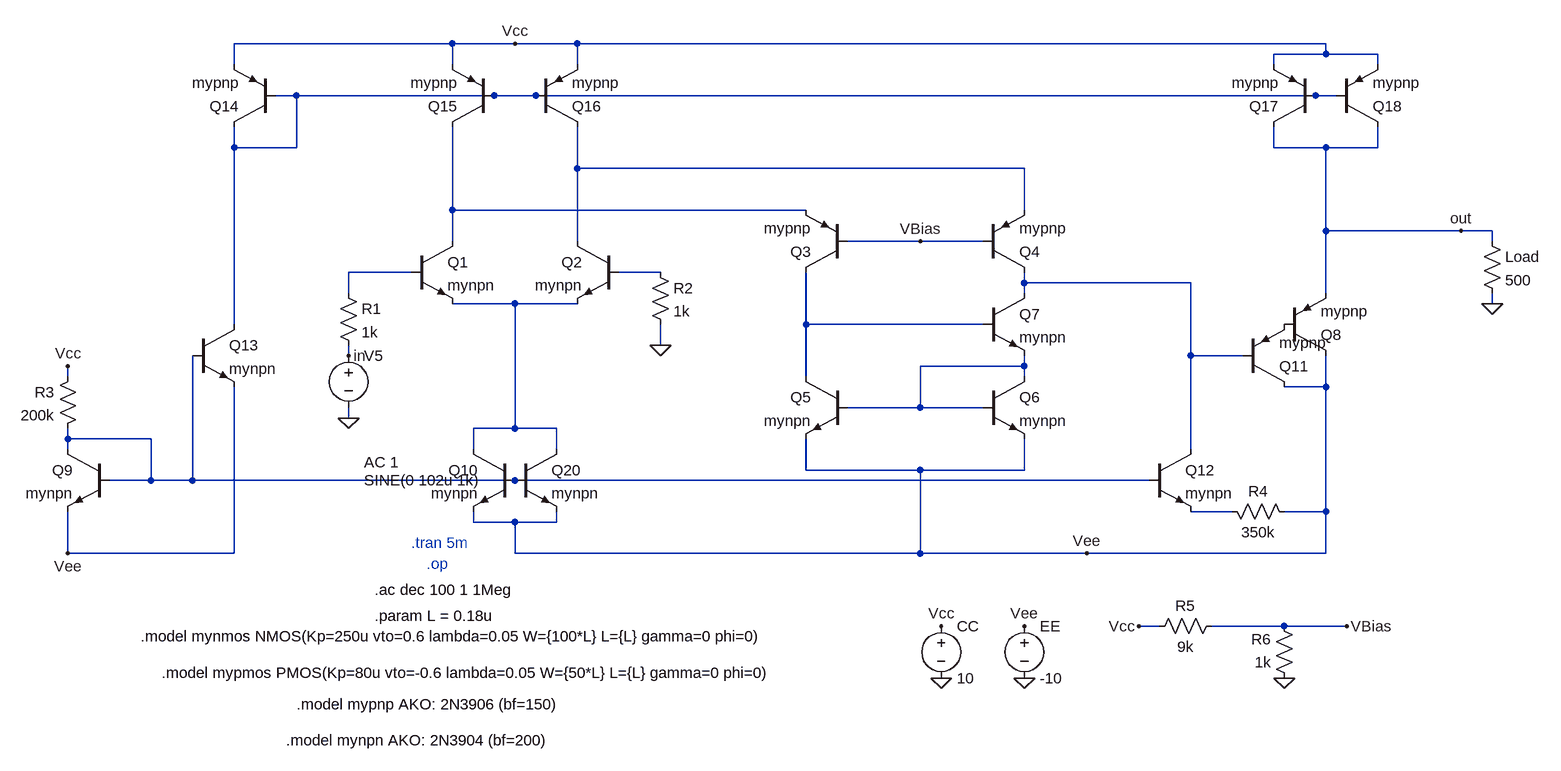
[diagram p0: schematic Ph1.asc]
Ph1.asc, the LTspice schematic file:
Version 4.1
SHEET 1 2180 916
WIRE 384 -320 48 -320
WIRE 480 -320 384 -320
WIRE 576 -320 480 -320
WIRE 1728 -320 576 -320
WIRE 1728 -304 1728 -320
WIRE 1728 -304 1648 -304
WIRE 1808 -304 1728 -304
WIRE 48 -288 48 -320
WIRE 384 -288 384 -320
WIRE 576 -288 576 -320
WIRE 1648 -288 1648 -304
WIRE 1808 -288 1808 -304
WIRE 144 -240 112 -240
WIRE 448 -240 144 -240
WIRE 512 -240 448 -240
WIRE 1712 -240 512 -240
WIRE 1744 -240 1712 -240
WIRE 48 -160 48 -192
WIRE 144 -160 144 -240
WIRE 144 -160 48 -160
WIRE 1648 -160 1648 -192
WIRE 1728 -160 1648 -160
WIRE 1808 -160 1808 -192
WIRE 1808 -160 1728 -160
WIRE 576 -128 576 -192
WIRE 1264 -128 576 -128
WIRE 384 -64 384 -192
WIRE 928 -64 384 -64
WIRE 1264 -64 1264 -128
WIRE 1728 -32 1728 -160
WIRE 1936 -32 1728 -32
WIRE 1984 -32 1936 -32
WIRE 384 -16 384 -64
WIRE 576 -16 576 -128
WIRE 1104 -16 992 -16
WIRE 1200 -16 1104 -16
WIRE 1984 -16 1984 -32
WIRE 320 32 224 32
WIRE 704 32 640 32
WIRE 1264 48 1264 32
WIRE 1520 48 1264 48
WIRE 224 64 224 32
WIRE 1264 64 1264 48
WIRE 1728 64 1728 -32
WIRE 480 80 384 80
WIRE 576 80 480 80
WIRE 1984 80 1984 64
WIRE 48 112 48 -160
WIRE 928 112 928 32
WIRE 1200 112 928 112
WIRE 704 144 704 112
WIRE 224 160 224 144
WIRE 1520 160 1520 48
WIRE 1600 160 1520 160
WIRE 1264 176 1264 160
WIRE 1264 176 1104 176
WIRE -208 192 -208 176
WIRE 928 192 928 112
WIRE 1264 192 1264 176
WIRE 1728 208 1728 160
WIRE 1728 208 1664 208
WIRE 1104 240 1104 176
WIRE 1104 240 992 240
WIRE 1200 240 1104 240
WIRE 224 256 224 240
WIRE 480 272 480 80
WIRE 480 272 416 272
WIRE 544 272 480 272
WIRE -208 288 -208 272
WIRE -80 288 -208 288
WIRE -208 304 -208 288
WIRE 416 304 416 272
WIRE 544 304 544 272
WIRE 1520 304 1520 160
WIRE 928 336 928 288
WIRE 1104 336 928 336
WIRE 1264 336 1264 288
WIRE 1264 336 1104 336
WIRE -80 352 -80 288
WIRE -80 352 -144 352
WIRE -16 352 -16 160
WIRE -16 352 -80 352
WIRE 480 352 -16 352
WIRE 1456 352 480 352
WIRE 1584 400 1520 400
WIRE 1728 400 1728 208
WIRE 1728 400 1664 400
WIRE 416 416 416 400
WIRE 480 416 416 416
WIRE 544 416 544 400
WIRE 544 416 480 416
WIRE -208 464 -208 400
WIRE 48 464 48 208
WIRE 48 464 -208 464
WIRE 480 464 480 416
WIRE 1104 464 1104 336
WIRE 1104 464 480 464
WIRE 1360 464 1104 464
WIRE 1728 464 1728 400
WIRE 1728 464 1360 464
WIRE 1472 576 1440 576
WIRE 1664 576 1552 576
WIRE 1760 576 1664 576
FLAG 1136 656 0
FLAG 1264 656 0
FLAG 1136 576 Vcc
FLAG 1264 576 Vee
FLAG 224 256 0
FLAG 480 -320 Vcc
FLAG 1984 80 0
FLAG 1936 -32 out
FLAG 1360 464 Vee
FLAG -208 464 Vee
FLAG -208 176 Vcc
FLAG 1664 656 0
FLAG 1440 576 Vcc
FLAG 1760 576 VBias
FLAG 1104 -16 VBias
FLAG 704 144 0
FLAG 224 160 in
DATAFLAG 384 -128 ""
DATAFLAG 256 32 ""
DATAFLAG 1344 48 ""
SYMBOL voltage 1136 560 R0
WINDOW 123 0 0 Left 0
WINDOW 39 0 0 Left 0
SYMATTR InstName CC
SYMATTR Value 10
SYMBOL voltage 1264 560 R0
WINDOW 123 0 0 Left 0
WINDOW 39 0 0 Left 0
SYMATTR InstName EE
SYMATTR Value -10
SYMBOL res 208 48 R0
SYMATTR InstName R1
SYMATTR Value 1k
SYMBOL npn 320 -16 R0
SYMATTR InstName Q1
SYMATTR Value mynpn
SYMBOL npn 640 -16 M0
SYMATTR InstName Q2
SYMATTR Value mynpn
SYMBOL res 688 16 R0
SYMATTR InstName R2
SYMATTR Value 1k
SYMBOL pnp 992 32 R180
SYMATTR InstName Q3
SYMATTR Value mypnp
SYMBOL pnp 1200 32 M180
SYMATTR InstName Q4
SYMATTR Value mypnp
SYMBOL npn 992 192 M0
SYMATTR InstName Q5
SYMATTR Value mynpn
SYMBOL npn 1200 192 R0
SYMATTR InstName Q6
SYMATTR Value mynpn
SYMBOL npn 1200 64 R0
SYMATTR InstName Q7
SYMATTR Value mynpn
SYMBOL res 1968 -32 R0
SYMATTR InstName Load
SYMATTR Value 500
SYMBOL npn -144 304 M0
SYMATTR InstName Q9
SYMATTR Value mynpn
SYMBOL res -192 176 M0
SYMATTR InstName R3
SYMATTR Value 200k
SYMBOL npn 480 304 M0
SYMATTR InstName Q10
SYMATTR Value mynpn
SYMBOL npn 1456 304 R0
SYMATTR InstName Q12
SYMATTR Value mynpn
SYMBOL res 1568 384 M90
WINDOW 0 0 56 VBottom 2
WINDOW 3 32 56 VTop 2
SYMATTR InstName R4
SYMATTR Value 350k
SYMBOL npn -16 112 R0
SYMATTR InstName Q13
SYMATTR Value mynpn
SYMBOL pnp 112 -192 R180
WINDOW 123 84 4 Left 2
SYMATTR InstName Q14
SYMATTR Value mypnp
SYMBOL pnp 448 -192 R180
WINDOW 123 84 4 Left 2
SYMATTR InstName Q15
SYMATTR Value mypnp
SYMBOL pnp 512 -192 M180
WINDOW 123 84 4 Left 2
SYMATTR InstName Q16
SYMATTR Value mypnp
SYMBOL pnp 1712 -192 R180
SYMATTR InstName Q17
SYMATTR Value mypnp
SYMBOL pnp 1744 -192 M180
SYMATTR InstName Q18
SYMATTR Value mypnp
SYMBOL npn 480 304 R0
SYMATTR InstName Q20
SYMATTR Value mynpn
SYMBOL voltage 224 144 R0
WINDOW 3 24 208 Left 2
WINDOW 123 24 180 Left 2
WINDOW 39 0 0 Left 0
SYMATTR Value SINE(0 102u 1k)
SYMATTR Value2 AC 1
SYMATTR InstName V5
SYMBOL pnp 1664 160 M180
SYMATTR InstName Q8
SYMATTR Value mypnp
SYMBOL pnp 1600 208 M180
SYMATTR InstName Q11
SYMATTR Value mypnp
SYMBOL res 1568 560 R90
WINDOW 0 0 56 VBottom 2
WINDOW 3 32 56 VTop 2
SYMATTR InstName R5
SYMATTR Value 9k
SYMBOL res 1680 672 R180
WINDOW 0 36 76 Left 2
WINDOW 3 36 40 Left 2
SYMATTR InstName R6
SYMATTR Value 1k
TEXT 264 560 Left 2 !.param L = 0.18u
TEXT -96 592 Left 2 !.model mynmos NMOS(Kp=250u vto=0.6 lambda=0.05 W={100*L} L={L} gamma=0 phi=0)
TEXT -64 648 Left 2 !.model mypmos PMOS(Kp=80u vto=-0.6 lambda=0.05 W={50*L} L={L} gamma=0 phi=0)
TEXT 144 696 Left 2 !.model mypnp AKO: 2N3906 (bf=150)
TEXT 128 752 Left 2 !.model mynpn AKO: 2N3904 (bf=200)
TEXT 344 480 Left 2 ;.op
TEXT 264 520 Left 2 !.ac dec 100 1 1Meg
TEXT 320 448 Left 2 ;.tran 5m

The netlist it stands for:
* Ph1.asc
V§CC Vcc 0 10
V§EE Vee 0 -10
R1 N004 in 1k
Q1 N003 N004 N007 0 mynpn
Q2 N002 N005 N007 0 mynpn
R2 N005 0 1k
Q3 N008 VBias N003 0 mypnp
Q4 N006 VBias N002 0 mypnp
Q5 N008 N009 Vee 0 mynpn
Q6 N009 N009 Vee 0 mynpn
Q7 N006 N008 N009 0 mynpn
R§Load out 0 500
Q9 N010 N010 Vee 0 mynpn
R3 Vcc N010 200k
Q10 N007 N010 Vee 0 mynpn
Q12 N006 N010 N011 0 mynpn
R4 N011 Vee 350k
Q13 N001 N010 Vee 0 mynpn
Q14 N001 N001 Vcc 0 mypnp
Q15 N003 N001 Vcc 0 mypnp
Q16 N002 N001 Vcc 0 mypnp
Q17 out N001 Vcc 0 mypnp
Q18 out N001 Vcc 0 mypnp
Q20 N007 N010 Vee 0 mynpn
V5 in 0 SINE(0 102u 1k) AC 1
Q8 Vee P001 out 0 mypnp
Q11 Vee N006 P001 0 mypnp
R5 VBias Vcc 9k
R6 0 VBias 1k
.model NPN NPN
.model PNP PNP
.lib standard.bjt
.param L = 0.18u
.model mynmos NMOS(Kp=250u vto=0.6 lambda=0.05 W={100*L} L={L} gamma=0 phi=0)
.model mypmos PMOS(Kp=80u vto=-0.6 lambda=0.05 W={50*L} L={L} gamma=0 phi=0)
.model mypnp AKO: 2N3906 (bf=150)
.model mynpn AKO: 2N3904 (bf=200)
* .op
.ac dec 100 1 1Meg
* .tran 5m
.backanno
.end